# EAGLE schematic Awesome-Shield-0.5 (EAGLE 7.2.0)
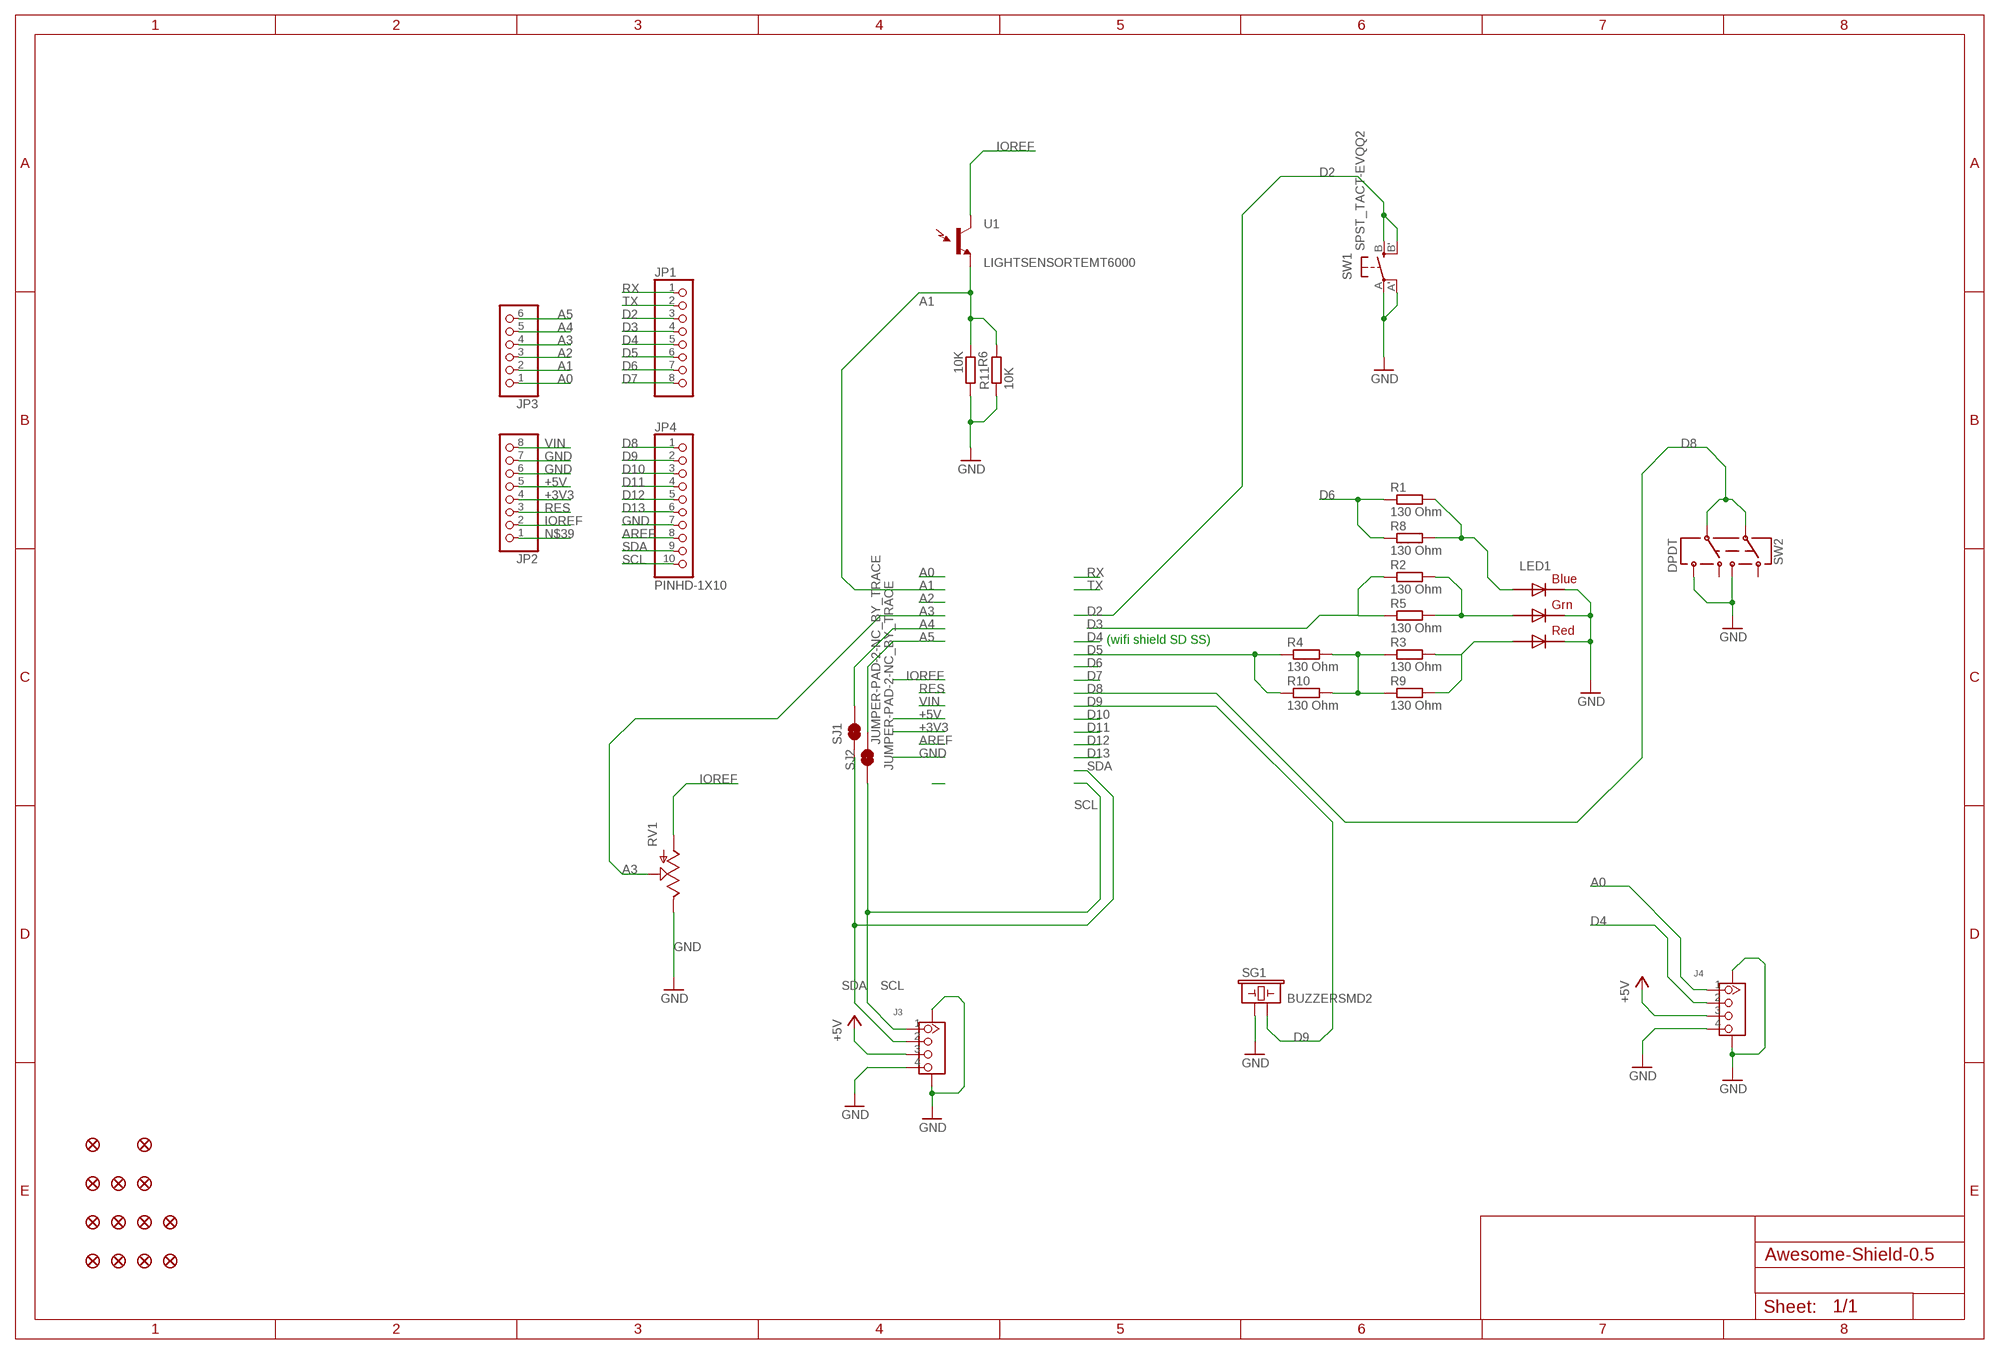
[diagram p0: schematic, sheet 1]

## Parts
FID1  FIDUCIAL1X2  [FIDUCIAL-1X2]
FID2  FIDUCIAL1X2  [FIDUCIAL-1X2]
FID3  FIDUCIAL1X2  [FIDUCIAL-1X2]
FID4  FIDUCIAL1X2  [FIDUCIAL-1X2]
FID5  FIDUCIALUFIDUCIAL  [MICRO-FIDUCIAL]
FID6  FIDUCIALUFIDUCIAL  [MICRO-FIDUCIAL]
FID7  FIDUCIALUFIDUCIAL  [MICRO-FIDUCIAL]
FID8  FIDUCIALUFIDUCIAL  [MICRO-FIDUCIAL]
FID9  FIDUCIALUFIDUCIAL  [MICRO-FIDUCIAL]
FID10  FIDUCIALUFIDUCIAL  [MICRO-FIDUCIAL]
FID11  FIDUCIALUFIDUCIAL  [MICRO-FIDUCIAL]
FID13  FIDUCIALUFIDUCIAL  [MICRO-FIDUCIAL]
FID15  FIDUCIALUFIDUCIAL  [MICRO-FIDUCIAL]
J3  GROVE-CONNECTOR-SMD(4+2P-2.0)  [HW4-SMD-2.0]
J4  GROVE-CONNECTOR-SMD(4+2P-2.0)  [HW4-SMD-2.0]
JP1  PINHD-1X8CLEANBIG  [1X08-CLEANBIG]
JP2  PINHD-1X8CLEANBIG  [1X08-CLEANBIG]
JP3  PINHD-1X6CLEAN  [1X06-CLEAN]
JP4  PINHD-1X10  [1X10-BIG]
LED1  RGBLED5050  [RGBLED5050]
R1  130 Ohm  R-EU_R1206  [R1206]
R2  130 Ohm  R-EU_R1206  [R1206]
R3  130 Ohm  R-EU_R1206  [R1206]
R4  130 Ohm  R-EU_R1206  [R1206]
R5  130 Ohm  R-EU_R0603  [R0603]
R6  10K  R-EU_R1206  [R1206]
R8  130 Ohm  R-EU_R0603  [R0603]
R9  130 Ohm  R-EU_R0603  [R0603]
R10  130 Ohm  R-EU_R0603  [R0603]
R11  10K  R-EU_R0603  [R0603]
RV1  POT  [ALPS_POT]
SG1  BUZZERSMD2  [BUZZER-CCV]
SJ1  JUMPER-PAD-2-NC_BY_TRACE  [PAD-JUMPER-2-NC_BY_TRACE_YES_SILK]
SJ2  JUMPER-PAD-2-NC_BY_TRACE  [PAD-JUMPER-2-NC_BY_TRACE_YES_SILK]
SW1  SPST_TACT-EVQQ2  [EVQ-Q2]
SW2  DPDT  SWITCH-DPDTAYZ0202  [AYZ0202]
U1  LIGHTSENSORTEMT6000  [TEMT6000-SEN]

## Nets
+3V3: JP2.4
+5V: J3.3 J4.3 JP2.5
A0: J4.1 JP3.1
A1: JP3.2 R6.1 R11.2 U1.EMITTER(E1)
A2: JP3.3
A3: JP3.4 RV1.P$2(S)
A4: JP3.5 SJ1.2
A5: JP3.6 SJ2.2
AREF: JP4.8
D2: JP1.3 SW1.B'(S1) SW1.B(S)
D3: JP1.4 R2.1 R5.1
D4: J4.2 JP1.5
D5: JP1.6 R4.1 R10.1
D6: JP1.7 R1.1 R8.1
D7: JP1.8
D8: JP4.1 SW2.2 SW2.5
D9: JP4.2 SG1.-
D10: JP4.3
D11: JP4.4
D12: JP4.5
D13: JP4.6
GND: J3.4 J3.SS1 J3.SS2 J4.4 J4.SS1 J4.SS2 JP2.6 JP2.7 JP4.7 LED1.4(BLUE_C) LED1.5(RED_C) LED1.6(GREEN_C) R6.2 R11.1 RV1.P$1(E) SG1.+ SW1.A'(P1) SW1.A(P) SW2.3 SW2.6
IOREF: JP2.2 RV1.P$3(A) U1.COLLECTOR(C1)
N$2: R3.1 R4.2 R9.1 R10.2
N$3: LED1.2(RED_A) R3.2 R9.2
N$8: LED1.3(BLUE_A) R1.2 R8.2
N$9: LED1.1(GREEN_A) R2.2 R5.2
N$39: JP2.1
RES: JP2.3
RX: JP1.1
SCL: J3.1 JP4.10 SJ2.1
SDA: J3.2 JP4.9 SJ1.1
TX: JP1.2
VIN: JP2.8
Unconnected: SW2.1 SW2.4

## Notes on the sheet
- (wifi shield SD SS)

## Library data of the parts
FID1-FID11 FID13 FID15 = SparkFun-Aesthetics:FIDUCIAL: Fiducial Alignment Points Various fiducial points for machine vision alignment.
J3 J4 = Seeed-OPL-Connector:GROVE-CONNECTOR-SMD(4+2P-2.0): 320110030
JP1 JP2 = adafruit:PINHD-1X8: PIN HEADER
JP3 = adafruit:PINHD-1X6: PIN HEADER
JP4 = adafruit:PINHD-1X10: Pin header 1x10 0.1" spacing With round pins
LED1 = adafruit:RGBLED: For 5050 RGB LEDs, the order of the LEDs may vary from one manufacturer to another!
R1-R6 R8-R11 = rcl:R-EU_: RESISTOR, European symbol
RV1 = SparkFun-Electromechanical:POT; PROD_ID: RES-09177
SG1 = SparkFun-Electromechanical:BUZZER: Buzzer 12mm Spark Fun Electronics SKU : Comp-Buzzer
SJ1 SJ2 = SparkFun-Passives:JUMPER-PAD-2-NC_BY_TRACE
SW1 = adafruit:SPST_TACT: SMT 6mm switch, EVQQ2 series http://www.ladyada.net/library/eagle
SW2 = SparkFun-Electromechanical:SWITCH-DPDT: DPDT Version of the COM-00597; PROD_ID: SWCH-08179
U1 = SparkFun-Sensors:LIGHTSENSOR: Ambient Light Sensor Simple light detection sensor. Output varies with light intensity input. Spark Fun Electronics SKU : COM-08348

## Net classes
0 default: width 0.203 mm, drill 0.305 mm, clearance 0.152 mm